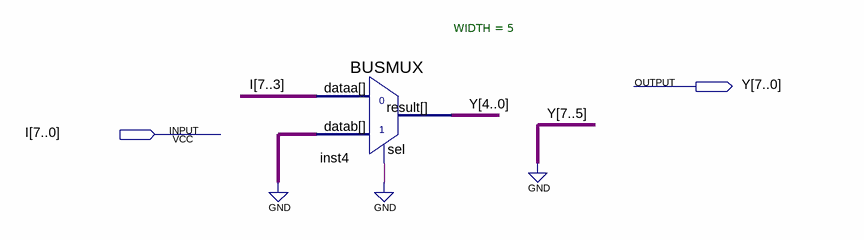
[diagram p0: schematic sheet]
// Quartus schematic SHIFTR3bit.bdf as structural Verilog: 1 symbols, 2 pins
module SHIFTR3bit (
  input  [7:0] I,
  output [7:0] Y
);

  BUSMUX #(.WIDTH(5)) inst4 (.datab({5{1'b0}}), .sel(1'b0), .dataa(I[7:3]), .result(Y[4:0]));

  assign Y[7:5] = 3'b000;
endmodule
